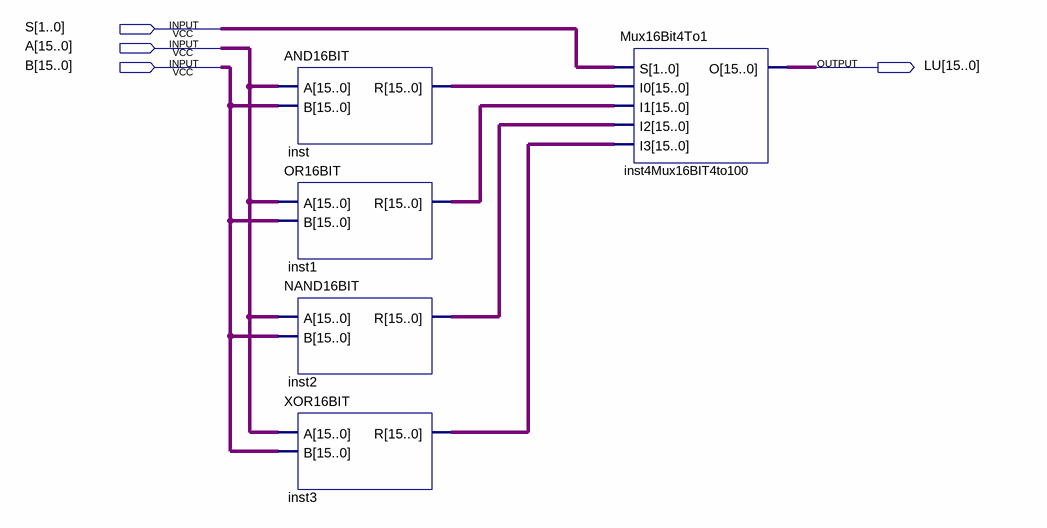
[diagram p0: schematic sheet]
// Quartus schematic LU.bdf as structural Verilog: 5 symbols, 4 pins
module LU (
  input  [1:0] S,
  input  [15:0] A,
  input  [15:0] B,
  output [15:0] LU
);

  wire [15:0] inst1_r, inst2_r, inst3_r, inst_r;

  AND16BIT inst (.A(A), .B(B), .R(inst_r));
  OR16BIT inst1 (.A(A), .B(B), .R(inst1_r));
  NAND16BIT inst2 (.A(A), .B(B), .R(inst2_r));
  XOR16BIT inst3 (.A(A), .B(B), .R(inst3_r));
  Mux16Bit4To1 inst4Mux16BIT4to100 (.S(S), .I0(inst_r), .I1(inst1_r), .I2(inst2_r), .I3(inst3_r), .O(LU));
endmodule
